# EAGLE design zumo_lb_01 (EAGLE 7.7.0)
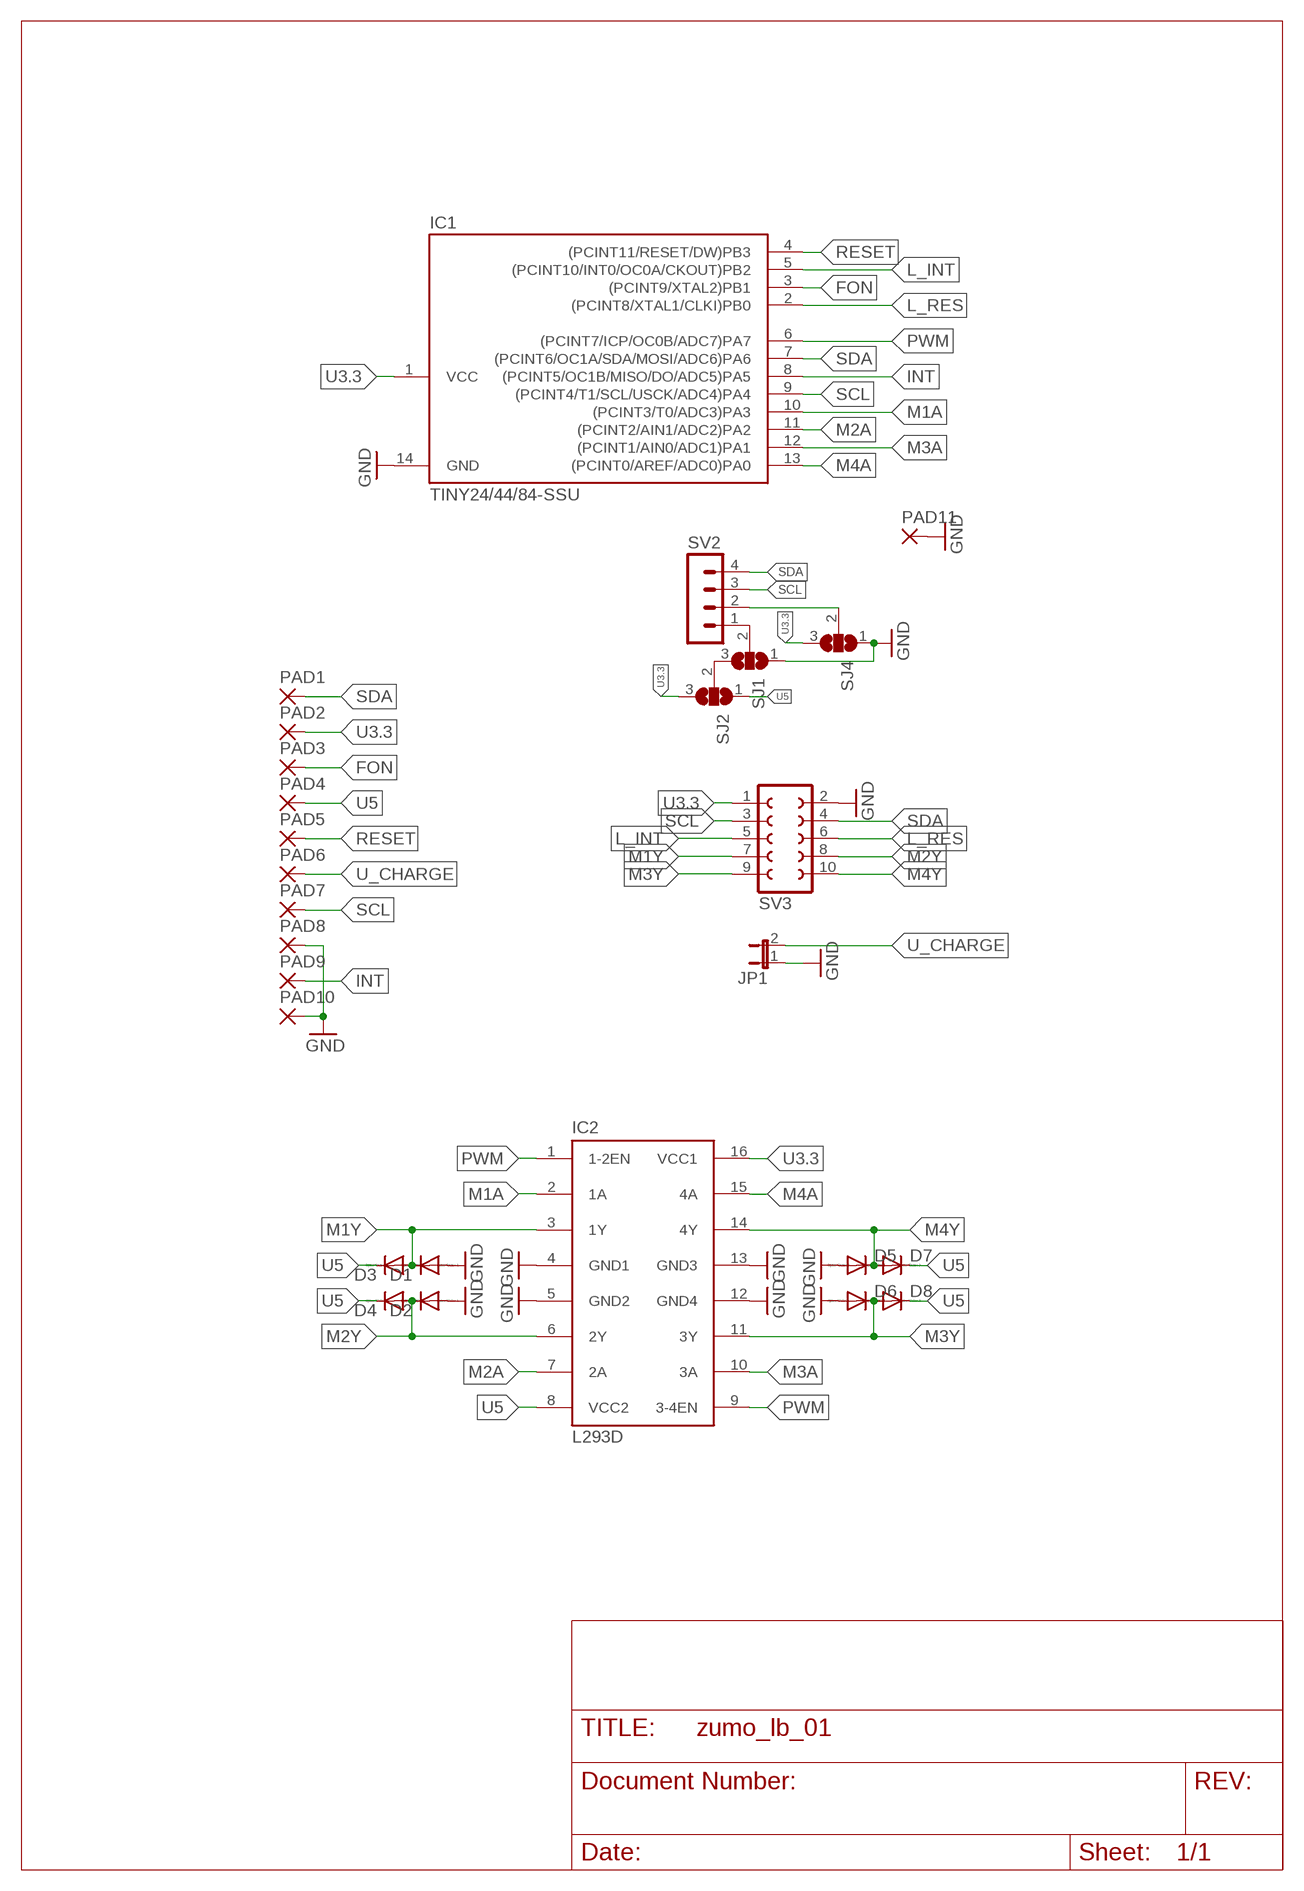
[diagram p0: schematic, sheet 1]

## Parts
D1  DIODE-MINIMELF  [MINIMELF]
D2  DIODE-MINIMELF  [MINIMELF]
D3  DIODE-MINIMELF  [MINIMELF]
D4  DIODE-MINIMELF  [MINIMELF]
D5  DIODE-MINIMELF  [MINIMELF]
D6  DIODE-MINIMELF  [MINIMELF]
D7  DIODE-MINIMELF  [MINIMELF]
D8  DIODE-MINIMELF  [MINIMELF]
IC1  TINY24/44/84-SSU  [SOIC14]
IC2  L293D  [DIL16]
JP1  JP1E  [JP1]
PAD1  SMD2  [SMD1,27-2,54]
PAD2  SMD2  [SMD1,27-2,54]
PAD3  SMD2  [SMD1,27-2,54]
PAD4  SMD2  [SMD1,27-2,54]
PAD5  SMD2  [SMD1,27-2,54]
PAD6  SMD2  [SMD1,27-2,54]
PAD7  SMD2  [SMD1,27-2,54]
PAD8  SMD2  [SMD1,27-2,54]
PAD9  SMD2  [SMD1,27-2,54]
PAD10  SMD2  [SMD1,27-2,54]
PAD11  3,81/1,4  [3,81/1,4]
SJ1  SJ2W  [SJ_2]
SJ2  SJ2W  [SJ_2]
SJ4  SJ2W  [SJ_2]
SV2  MA04-1  [MA04-1]
SV3  FE05-2  [FE05-2]

## Nets
FON: IC1.3((PCINT9/XTAL2)PB1) PAD3.1(P)
GND [gnd]: D1.A D2.A D5.A D6.A IC1.14(GND) IC2.4(GND1) IC2.5(GND2) IC2.12(GND4) IC2.13(GND3) JP1.1 PAD8.1(P) PAD10.1(P) PAD11.1(P) SJ1.1 SJ4.1 SV3.2
INT: IC1.8((PCINT5/OC1B/MISO/DO/ADC5)PA5) PAD9.1(P)
L_INT: IC1.5((PCINT10/INT0/OC0A/CKOUT)PB2) SV3.5
L_RES: IC1.2((PCINT8/XTAL1/CLKI)PB0) SV3.6
LCD_1 [power]: SJ1.2 SV2.1
LCD_2 [power]: SJ4.2 SV2.2
M1A: IC1.10((PCINT3/T0/ADC3)PA3) IC2.2(1A)
M1Y [gnd]: D1.C D3.A IC2.3(1Y) SV3.7
M2A: IC1.11((PCINT2/AIN1/ADC2)PA2) IC2.7(2A)
M2Y [gnd]: D2.C D4.A IC2.6(2Y) SV3.8
M3A: IC1.12((PCINT1/AIN0/ADC1)PA1) IC2.10(3A)
M3Y [gnd]: D6.C D8.A IC2.11(3Y) SV3.9
M4A: IC1.13((PCINT0/AREF/ADC0)PA0) IC2.15(4A)
M4Y [gnd]: D5.C D7.A IC2.14(4Y) SV3.10
N$2: SJ1.3 SJ2.2
PWM: IC1.6((PCINT7/ICP/OC0B/ADC7)PA7) IC2.1(1-2EN) IC2.9(3-4EN)
RESET: IC1.4((PCINT11/RESET/DW)PB3) PAD5.1(P)
SCL: IC1.9((PCINT4/T1/SCL/USCK/ADC4)PA4) PAD7.1(P) SV2.3 SV3.3
SDA: IC1.7((PCINT6/OC1A/SDA/MOSI/ADC6)PA6) PAD1.1(P) SV2.4 SV3.4
U3.3 [gnd]: IC1.1(VCC) IC2.16(VCC1) PAD2.1(P) SJ2.3 SJ4.3 SV3.1
U5 [gnd]: D3.C D4.C D7.C D8.C IC2.8(VCC2) PAD4.1(P) SJ2.1
U_CHARGE [gnd]: JP1.2 PAD6.1(P)

## Library data of the parts
D1-D8 = diode:DIODE-: DIODE
IC1 = avr-7:TINY24/44/84
IC2 = st-microelectronics:L293D: PUSH-PULL 4 CHANNEL DRIVER; MPN: L293D; OC_FARNELL: 9589619; OC_NEWARK: 56P8249
JP1 = jumper:JP1E: JUMPER
PAD1-PAD10 = wirepad:SMD2: SMD PAD
PAD11 = wirepad:3,81/1,4: THROUGH-HOLE PAD
SJ1 SJ2 SJ4 = jumper:SJ2W: SMD solder JUMPER
SV2 = con-lstb:MA04-1: PIN HEADER; OC_FARNELL: unknown; OC_NEWARK: unknown
SV3 = con-lsta:FE05-2: FEMALE HEADER; OC_FARNELL: unknown; OC_NEWARK: unknown

## Net classes
1 gnd: width 0.381 mm, drill 0.381 mm
2 power: width 0.381 mm, drill 0.381 mm

## Board
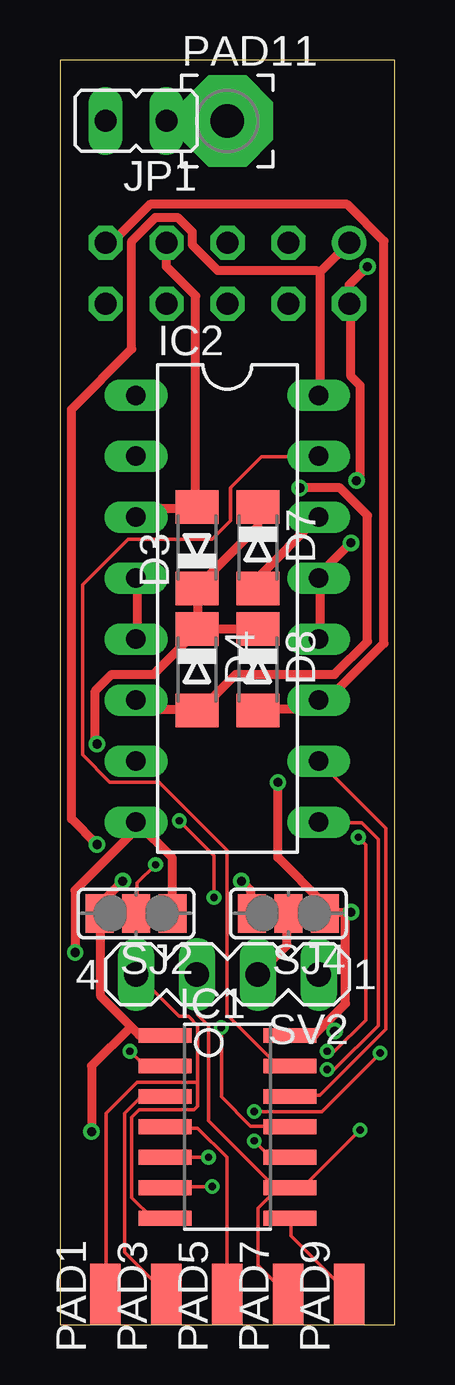
[diagram p1: board, top side]
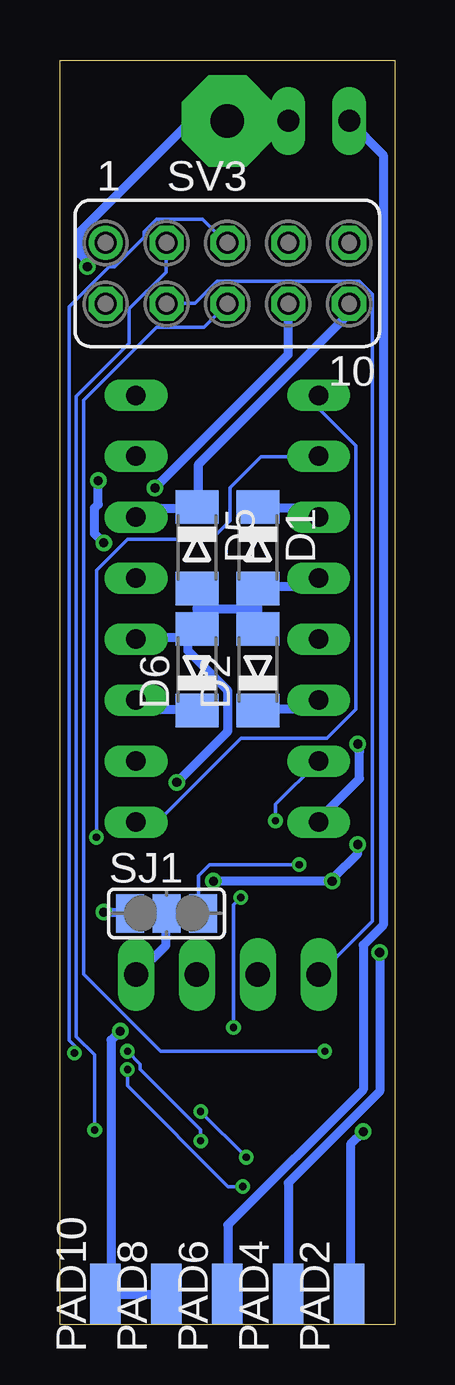
[diagram p2: board, bottom side, seen from below]

Size 13.97 x 52.71 mm. Coordinates in mm from the lower left corner, seen from the top.
Outline: 0,0 13.97,0 13.97,52.71 0,52.71 0,0
Copper layers (1*16): Top 0.035mm / dielectric 1.5mm / Bottom 0.035mm
Design rules "dirt_cheap_dirty_boards.v1.1": minimum track width 6mil, minimum drill 12mil, track to track 6mil, track to pad 6mil, pad to pad 6mil, via to via 6mil, smd to smd 0mil, copper to edge 10mil, drill to drill 10mil, minimum pad ring 10mil, minimum via ring 6mil, stop-mask expansion 2mil, vias tented up to drill 25mil, thermal gap 10mil

### Footprints (pad centres in the part's own frame; a part is rotated, then mirrored left to right if it is on the bottom)
MINIMELF = smd 1.4 x 1.8: A 1.7,0; C -1.7,0
SOIC14 = smd 0.61 x 2.21: 1 -3.81,-2.603; 2 -2.54,-2.603; 3 -1.27,-2.603; 4 0,-2.603; 5 1.27,-2.603; 6 2.54,-2.603; 7 3.81,-2.603; 8 3.81,2.603; 9 2.54,2.603; 10 1.27,2.603; 11 0,2.603; 12 -1.27,2.603; 13 -2.54,2.603; 14 -3.81,2.603
DIL16 = drill 0.813 long: 1 -8.89,-3.81; 2 -6.35,-3.81; 3 -3.81,-3.81; 4 -1.27,-3.81; 5 1.27,-3.81; 6 3.81,-3.81; 7 6.35,-3.81; 8 8.89,-3.81; 9 8.89,3.81; 10 6.35,3.81; 11 3.81,3.81; 12 1.27,3.81; 13 -1.27,3.81; 14 -3.81,3.81; 15 -6.35,3.81; 16 -8.89,3.81
JP1 = drill 0.914 long: 1 0,-1.27; 2 0,1.27
SMD1,27-2,54 = smd 1.27 x 2.54: 1 0,0
3,81/1,4 = drill 1.397 pad 3.81 octagon: 1 0,0
SJ_2 = smd 1.168 x 1.6: 1 -1.524,0; 2 0,0; 3 1.524,0
MA04-1 = drill 1.016 long: 1 -3.81,0; 2 -1.27,0; 3 1.27,0; 4 3.81,0
FE05-2 = drill 0.914: 1 -5.08,1.27 | drill 0.914 octagon: 2 -5.08,-1.27; 3 -2.54,1.27; 4 -2.54,-1.27; 5 0,1.27; 6 0,-1.27; 7 2.54,1.27; 8 2.54,-1.27; 9 5.08,1.27; 10 5.08,-1.27

### Placement (x,y rotation side)
D1  5.71,32.39 270 bottom
D2  5.71,27.3 90 bottom
D3  5.71,32.39 90 top
D4  5.71,27.3 270 top
D5  8.26,32.39 270 bottom
D6  8.26,27.3 90 bottom
D7  8.26,32.39 270 top
D8  8.26,27.3 270 top
IC1  6.98,8.26 270 top
IC2  6.98,29.84 270 top
JP1  3.17,50.16 90 top
PAD1  1.91,1.27 0 top
PAD2  1.91,1.27 0 bottom
PAD3  4.45,1.27 0 top
PAD4  4.45,1.27 0 bottom
PAD5  6.98,1.27 0 top
PAD6  6.98,1.27 0 bottom
PAD7  9.53,1.27 0 top
PAD8  9.53,1.27 0 bottom
PAD9  12.06,1.27 0 top
PAD10  12.06,1.27 0 bottom
PAD11  6.98,50.16 0 top
SJ1  9.53,17.14 0 bottom
SJ2  3.17,17.14 180 top
SJ4  9.53,17.14 180 top
SV2  6.98,14.61 180 top
SV3  6.98,43.82 0 bottom

### Tracks (layer width: path | path; a pad name or v marks a point on that pad's centre or on a via)
FON
  Top 0.152: PAD3.1 2.69,3.02 2.69,8.81 3.38,9.5 4.37,9.5 IC1.3
GND  (via drill 0.38)
  Top 0.381: v12.83,44.09 12.06,43.33 SV3.2 12.14,42.42 12.14,39.52 12.52,39.14 12.52,35.33 v12.37,35.18 | IC2.12 10.85,28.63 10.85,31.06 IC2.13 10.85,31.29 v12.14,32.59 | IC2.5 3.23,28.63 3.23,31.06 IC2.4 | 11.11,12.59 10.62,12.09 9.63,12.09 IC1.14 | 11.11,12.59 11.91,13.39 11.91,17.04 v12.14,17.2 11.07,17.2 SJ1.1 11,17.35 11,17.58 9.09,19.48 v9.09,22.61 | 11.11,12.59 v11.46,12.24
  Bottom 0.381: v12.83,44.09 12.83,44.32 13.13,44.63 13.13,45.54 8.56,50.11 7.04,50.11 PAD11.1 6.81,50.19 4.45,50.19 JP1.1 | 5.74,29.84 5.74,30.68 D1.A 5.59,30.76 3.53,30.76 IC2.4 | 5.74,29.84 5.74,29.01 D2.A | D5.A 8.26,29.84 | 8.26,29.84 D6.A | 8.26,29.84 5.74,29.84 | IC2.12 10.77,28.63 8.71,28.63 8.41,28.93 D6.A | PAD8.1 PAD10.1 11.84,1.42 11.84,11.86 v11.46,12.24 | v12.14,17.2 11.07,17.2 SJ1.1 | v9.09,22.61 6.96,24.74 6.96,26.42 8.64,28.09 8.64,28.47 D6.A | v12.37,35.18 12.37,34.19 12.52,34.04 12.52,32.97 v12.14,32.59
INT
  Top 0.152: PAD9.1 9.63,3.71 9.63,4.39 IC1.8
L_INT  (via drill 0.3)
  Top 0.152: v6.2,6.99 IC1.5 | v8.1,8.89 10.92,8.89 v13.36,11.33
  Bottom 0.152: v8.1,8.89 v6.2,6.99 | v13.36,11.33 13.36,11.63 13.59,11.86 13.59,42.42 11.91,44.09 11.68,44.09 10.46,45.31 10.46,45.54 9.93,46.08 8.03,46.08 7.04,45.09 SV3.5
L_RES  (via drill 0.3)
  Top 0.152: IC1.2 3.53,10.79 v2.92,11.4
  Bottom 0.152: v2.92,11.4 9.78,11.4 12.98,14.61 12.98,38.53 9.93,41.58 7.95,41.58 SV3.6
LCD_1
  Bottom 0.381: SJ1.2 9.55,17.12 9.55,15.82 10.77,14.61 SV2.1
LCD_2
  Top 0.381: SV2.2 9.47,15.82 9.47,17.12 SJ4.2
M1A  (via drill 0.3)
  Top 0.152: IC1.10 8.79,6.99 v8.1,7.67 | v11.15,11.4 11.46,11.4 12.75,12.7 12.75,20.01 v12.45,20.32
  Bottom 0.152: v8.1,7.67 8.1,8.13 10.62,10.64 10.62,10.87 v11.15,11.4 | v12.45,20.32 12.45,31.44 11.15,32.74 7.64,32.74 6.88,33.5 6.88,34.87 5.59,36.17 3.23,36.17 IC2.2
M1Y
  Top 0.381: IC2.3 3.23,33.66 3.61,34.04 5.66,34.04 D3.A 5.66,34.27 5.66,42.88 4.45,44.09 SV3.7
  Bottom 0.381: D3.A 5.66,34.04 3.61,34.04 3.23,33.66 IC2.3
M2A  (via drill 0.3)
  Top 0.152: v6.73,12.39 6.73,9.5 7.95,8.28 9.55,8.28 IC1.11 | v6.43,17.8 6.43,19.56 v4.98,21.01
  Bottom 0.152: v6.73,12.39 6.73,17.5 v6.43,17.8 | v4.98,21.01 4.98,21.69 IC2.7
M2Y  (via drill 0.38)
  Top 0.381: IC2.6 3.23,26.04 3.61,25.65 5.66,25.65 D4.A 5.89,25.65 7.34,27.1 11.46,27.1 12.83,28.47 12.83,33.73 11.68,34.87 v10.01,34.87
  Bottom 0.381: D4.A 5.66,25.65 3.61,25.65 3.23,26.04 IC2.6 | SV3.8 4.45,40.44 v10.01,34.87
M3A
  Top 0.152: IC2.10 13.59,20.7 13.59,12.32 10.85,9.58 9.63,9.58 IC1.12
M3Y
  Top 0.381: D8.A 8.26,25.65 10.39,25.65 10.77,26.04 IC2.11 10.92,26.11 11.23,26.11 13.51,28.4 13.51,45.16 11.99,46.69 3.76,46.69 2.16,45.09 SV3.9
  Bottom 0.381: D8.A 8.26,25.65 10.39,25.65 10.77,26.04 IC2.11
M4A
  Top 0.152: IC1.13 9.09,10.79 6.96,12.93 6.96,19.79 4.14,22.61 2.08,22.61 0.94,23.75 0.94,30.84 2.84,32.74 6.35,32.74 7.11,33.5 7.11,34.87 8.41,36.17 10.77,36.17 IC2.15
M4Y
  Top 0.381: D7.A 8.26,31.14 10.77,33.66 IC2.14
  Bottom 0.381: IC2.14 10.77,33.66 10.39,34.04 8.26,34.04 D5.C 8.18,34.27 8.18,35.87 1.93,42.11 1.93,42.49 SV3.10
N$2  (via drill 0.3)
  Top 0.152: v3.99,19.18 3.23,18.41 3.23,17.2 SJ2.2
  Bottom 0.152: v3.99,19.18 7.72,19.18 8.18,18.72 8.18,17.35 8.03,17.2 SJ1.3
PWM  (via drill 0.3)
  Top 0.152: v6.35,5.77 4.45,5.77 IC1.6 | v11.15,10.64 11.46,10.64 13.28,12.47 13.28,20.24 12.6,20.93 10.85,20.93 IC2.9
  Bottom 0.152: v6.35,5.77 6.96,5.77 11.15,9.96 v11.15,10.64 | IC2.1 3.15,38.68 3.15,38.15 1.63,36.63 1.63,25.65 2.84,24.43 6.43,24.43 9.86,21.01 10.77,21.01 IC2.9
RESET
  Top 0.152: IC1.4 4.45,8.2 5.74,8.2 6.96,6.99 6.96,1.27 PAD5.1
SCL  (via drill 0.3)
  Top 0.152: IC1.9 9.55,5.69 9.09,5.69 8.26,4.85 8.26,2.49 9.47,1.27 PAD7.1 | v12.52,8.13 10.16,5.77 9.63,5.77 IC1.9 | SV2.3 5.74,14.61 5.74,12.93 6.2,12.47 6.2,8.51 9.02,5.69 IC1.9
  Bottom 0.152: v12.52,8.13 12.52,11.25 13.28,12.01 13.28,38.68 11.07,40.89 11.07,42.34 9.55,43.87 9.55,45.09 SV3.3
SDA
  Top 0.152: 5.74,10.11 5.74,12.47 5.36,12.85 4.98,12.85 3.23,14.61 SV2.4 | 5.74,10.11 5.74,9.12 5.59,8.97 3.3,8.97 3,8.66 3,5.31 3.83,4.47 4.37,4.47 IC1.7 | 5.74,10.11 3.23,10.11 1.93,8.81 1.93,1.27 PAD1.1
  Bottom 0.152: SV3.4 9.47,42.57 8.33,42.57 7.42,43.48 1.47,43.48 0.94,42.95 0.94,16.81 3.15,14.61 SV2.4
U3.3  (via drill 0.38)
  Top 0.381: 10.85,43.87 10.85,38.76 IC2.16 | SV3.1 10.85,43.87 | 2.96,12.43 3.3,12.09 4.37,12.09 IC1.1 | 2.96,12.43 1.7,13.69 1.7,17.12 SJ2.3 1.78,17.27 1.78,17.65 v2.62,18.49 | v7.57,18.49 7.95,18.11 7.95,17.2 SJ4.3 | v1.32,8.05 1.32,10.79 2.96,12.43 | v1.55,20.01 0.48,21.08 0.48,38.15 3,40.66 3,45.16 3.99,46.15 4.9,46.15 5.51,45.54 5.51,45.01 6.58,43.94 10.69,43.94 10.85,43.87
  Bottom 0.381: v7.57,18.49 v2.62,18.49 2.54,18.64 1.55,19.63 v1.55,20.01 | v1.32,8.05 1.85,7.52 1.85,1.27 PAD2.1
U5  (via drill 0.38)
  Top 0.381: D4.C 5.74,29.01 5.74,30.68 D3.C 5.82,30.84 8.26,33.27 D7.C | D8.C 5.89,29.01 D4.C | SJ2.1 4.67,17.2 4.67,19.48 3.23,20.93 IC2.8 3.23,20.7 0.64,18.11 v0.64,15.52 | v1.55,24.21 1.47,24.28 1.47,26.42 2.16,27.1 3.91,27.1 5.66,28.85 D4.C
  Bottom 0.381: PAD4.1 4.45,5.92 0.64,9.73 v0.64,15.52 | v1.55,24.21 1.55,23.98 1.47,23.9 1.47,22.76 3.23,21.01 IC2.8
U_CHARGE
  Bottom 0.381: JP1.2 0.48,48.74 0.48,16.66 1.32,15.82 1.32,9.8 6.96,4.17 6.96,1.27 PAD6.1